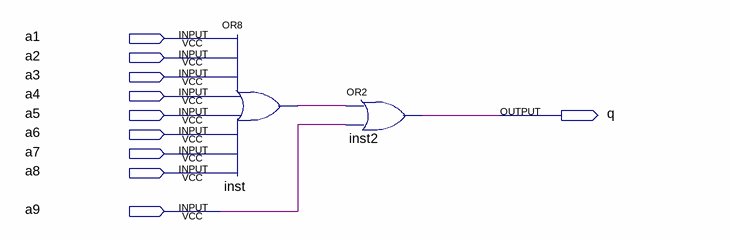
[diagram p0: schematic sheet]
// Quartus schematic WN_or9.bdf as structural Verilog: 2 symbols, 10 pins
module WN_or9 (
  input  a1,
  input  a2,
  input  a3,
  input  a4,
  input  a5,
  input  a6,
  input  a7,
  input  a8,
  input  a9,
  output q
);

  wire inst_out;

  or inst (inst_out, a1, a2, a3, a4, a5, a6, a7, a8);
  or inst2 (q, inst_out, a9);
endmodule
